# EAGLE schematic SpectrumPlusKeyboardRGB (EAGLE 7.6.0)
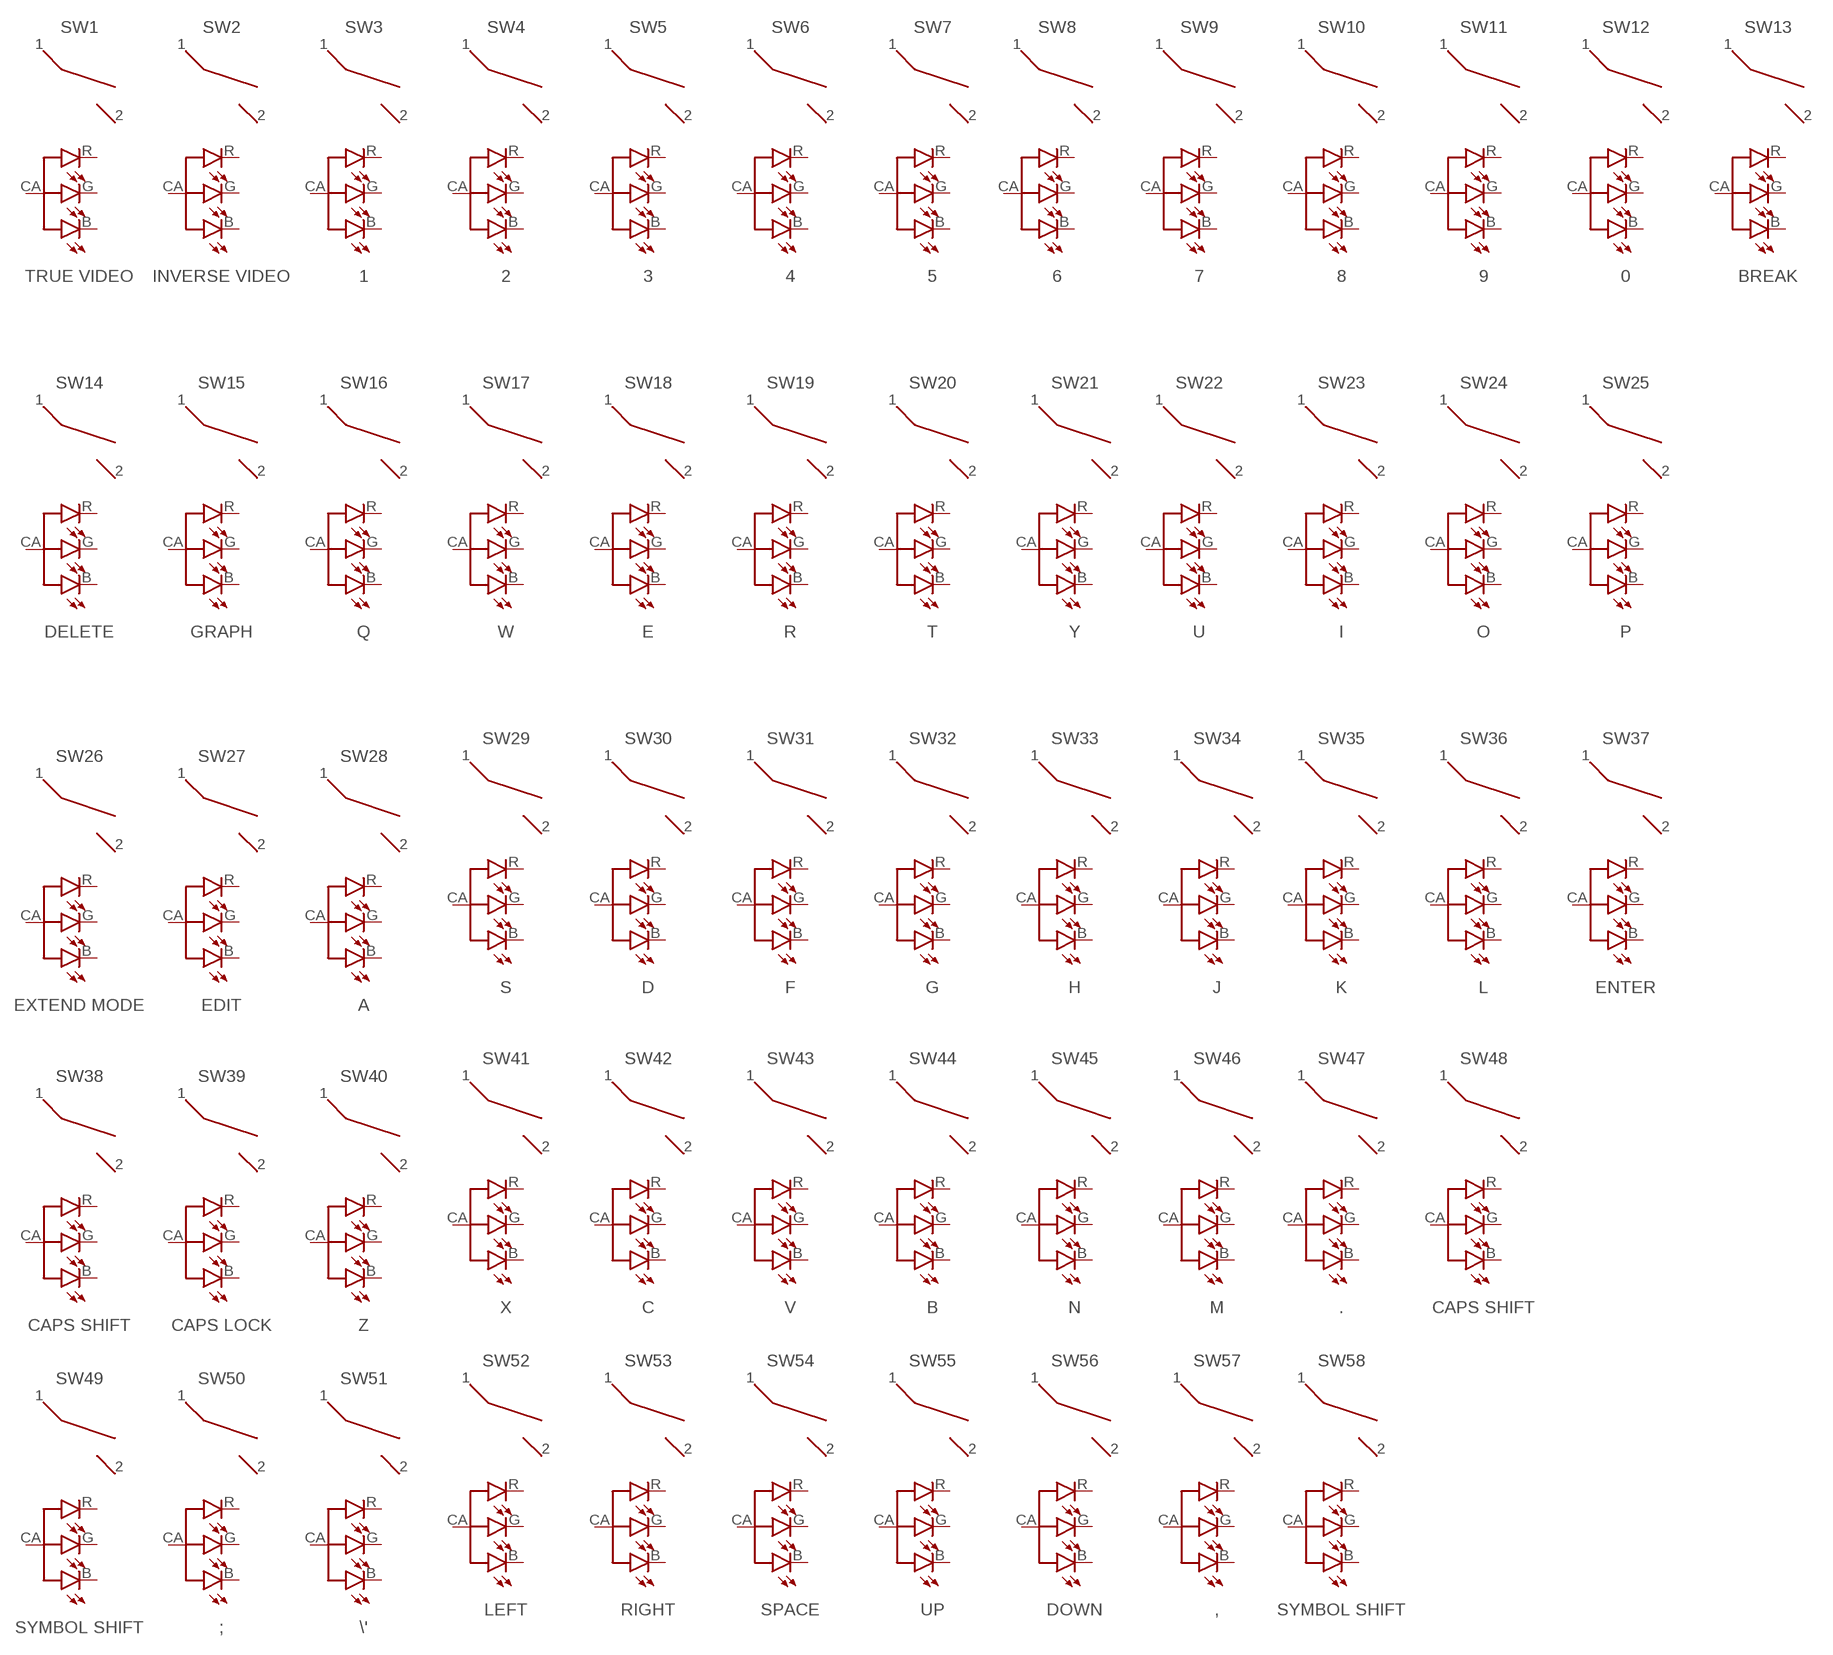
[diagram p0: schematic, sheet 1]

## Parts
SW1  TRUE VIDEO  ZEALIOSZX_1U  [ZX_1U]
SW2  INVERSE VIDEO  ZEALIOSZX_1U  [ZX_1U]
SW3  1  ZEALIOSZX_1U  [ZX_1U]
SW4  2  ZEALIOSZX_1U  [ZX_1U]
SW5  3  ZEALIOSZX_1U  [ZX_1U]
SW6  4  ZEALIOSZX_1U  [ZX_1U]
SW7  5  ZEALIOSZX_1U  [ZX_1U]
SW8  6  ZEALIOSZX_1U  [ZX_1U]
SW9  7  ZEALIOSZX_1U  [ZX_1U]
SW10  8  ZEALIOSZX_1U  [ZX_1U]
SW11  9  ZEALIOSZX_1U  [ZX_1U]
SW12  0  ZEALIOSZX_1U  [ZX_1U]
SW13  BREAK  ZEALIOSZX_1.5U  [ZX_1.5U]
SW14  DELETE  ZEALIOSZX_1.5U  [ZX_1.5U]
SW15  GRAPH  ZEALIOSZX_1U  [ZX_1U]
SW16  Q  ZEALIOSZX_1U  [ZX_1U]
SW17  W  ZEALIOSZX_1U  [ZX_1U]
SW18  E  ZEALIOSZX_1U  [ZX_1U]
SW19  R  ZEALIOSZX_1U  [ZX_1U]
SW20  T  ZEALIOSZX_1U  [ZX_1U]
SW21  Y  ZEALIOSZX_1U  [ZX_1U]
SW22  U  ZEALIOSZX_1U  [ZX_1U]
SW23  I  ZEALIOSZX_1U  [ZX_1U]
SW24  O  ZEALIOSZX_1U  [ZX_1U]
SW25  P  ZEALIOSZX_1U  [ZX_1U]
SW26  EXTEND MODE  ZEALIOSZX_1.5U  [ZX_1.5U]
SW27  EDIT  ZEALIOSZX_1.25U  [ZX_1.25U]
SW28  A  ZEALIOSZX_1U  [ZX_1U]
SW29  S  ZEALIOSZX_1U  [ZX_1U]
SW30  D  ZEALIOSZX_1U  [ZX_1U]
SW31  F  ZEALIOSZX_1U  [ZX_1U]
SW32  G  ZEALIOSZX_1U  [ZX_1U]
SW33  H  ZEALIOSZX_1U  [ZX_1U]
SW34  J  ZEALIOSZX_1U  [ZX_1U]
SW35  K  ZEALIOSZX_1U  [ZX_1U]
SW36  L  ZEALIOSZX_1U  [ZX_1U]
SW37  ENTER  ZEALIOSZX_ENTER  [ZX_ENTER]
SW38  CAPS SHIFT  ZEALIOSZX_2.3U  [ZX_2.3U]
SW39  CAPS LOCK  ZEALIOSZX_1U  [ZX_1U]
SW40  Z  ZEALIOSZX_1U  [ZX_1U]
SW41  X  ZEALIOSZX_1U  [ZX_1U]
SW42  C  ZEALIOSZX_1U  [ZX_1U]
SW43  V  ZEALIOSZX_1U  [ZX_1U]
SW44  B  ZEALIOSZX_1U  [ZX_1U]
SW45  N  ZEALIOSZX_1U  [ZX_1U]
SW46  M  ZEALIOSZX_1U  [ZX_1U]
SW47  .  ZEALIOSZX_1U  [ZX_1U]
SW48  CAPS SHIFT  ZEALIOSZX_2.3U  [ZX_2.3U]
SW49  SYMBOL SHIFT  ZEALIOSZX_1U  [ZX_1U]
SW50  ;  ZEALIOSZX_1U  [ZX_1U]
SW51  \'  ZEALIOSZX_1U  [ZX_1U]
SW52  LEFT  ZEALIOSZX_1U  [ZX_1U]
SW53  RIGHT  ZEALIOSZX_1U  [ZX_1U]
SW54  SPACE  ZEALIOSZX_SPACE  [ZX_SPACE]
SW55  UP  ZEALIOSZX_1U  [ZX_1U]
SW56  DOWN  ZEALIOSZX_1U  [ZX_1U]
SW57  ,  ZEALIOSZX_1U  [ZX_1U]
SW58  SYMBOL SHIFT  ZEALIOSZX_1U  [ZX_1U]
Unconnected: SW1.1 SW1.2 SW1.B(B-CAT) SW1.CA(COMMON-ANODE) SW1.G(G-CAT) SW1.R(R-CAT) SW2.1 SW2.2 SW2.B(B-CAT) SW2.CA(COMMON-ANODE) SW2.G(G-CAT) SW2.R(R-CAT) SW3.1 SW3.2 SW3.B(B-CAT) SW3.CA(COMMON-ANODE) SW3.G(G-CAT) SW3.R(R-CAT) SW4.1 SW4.2 SW4.B(B-CAT) SW4.CA(COMMON-ANODE) SW4.G(G-CAT) SW4.R(R-CAT) SW5.1 SW5.2 SW5.B(B-CAT) SW5.CA(COMMON-ANODE) SW5.G(G-CAT) SW5.R(R-CAT) SW6.1 SW6.2 SW6.B(B-CAT) SW6.CA(COMMON-ANODE) SW6.G(G-CAT) SW6.R(R-CAT) SW7.1 SW7.2 SW7.B(B-CAT) SW7.CA(COMMON-ANODE) SW7.G(G-CAT) SW7.R(R-CAT) SW8.1 SW8.2 SW8.B(B-CAT) SW8.CA(COMMON-ANODE) SW8.G(G-CAT) SW8.R(R-CAT) SW9.1 SW9.2 SW9.B(B-CAT) SW9.CA(COMMON-ANODE) SW9.G(G-CAT) SW9.R(R-CAT) SW10.1 SW10.2 SW10.B(B-CAT) SW10.CA(COMMON-ANODE) SW10.G(G-CAT) SW10.R(R-CAT) SW11.1 SW11.2 SW11.B(B-CAT) SW11.CA(COMMON-ANODE) SW11.G(G-CAT) SW11.R(R-CAT) SW12.1 SW12.2 SW12.B(B-CAT) SW12.CA(COMMON-ANODE) SW12.G(G-CAT) SW12.R(R-CAT) SW13.1 SW13.2 SW13.B(B-CAT) SW13.CA(COMMON-ANODE) SW13.G(G-CAT) SW13.R(R-CAT) SW14.1 SW14.2 SW14.B(B-CAT) SW14.CA(COMMON-ANODE) SW14.G(G-CAT) SW14.R(R-CAT) SW15.1 SW15.2 SW15.B(B-CAT) SW15.CA(COMMON-ANODE) SW15.G(G-CAT) SW15.R(R-CAT) SW16.1 SW16.2 SW16.B(B-CAT) SW16.CA(COMMON-ANODE) SW16.G(G-CAT) SW16.R(R-CAT) SW17.1 SW17.2 SW17.B(B-CAT) SW17.CA(COMMON-ANODE) SW17.G(G-CAT) SW17.R(R-CAT) SW18.1 SW18.2 SW18.B(B-CAT) SW18.CA(COMMON-ANODE) SW18.G(G-CAT) SW18.R(R-CAT) SW19.1 SW19.2 SW19.B(B-CAT) SW19.CA(COMMON-ANODE) SW19.G(G-CAT) SW19.R(R-CAT) SW20.1 SW20.2 SW20.B(B-CAT) SW20.CA(COMMON-ANODE) SW20.G(G-CAT) SW20.R(R-CAT) SW21.1 SW21.2 SW21.B(B-CAT) SW21.CA(COMMON-ANODE) SW21.G(G-CAT) SW21.R(R-CAT) SW22.1 SW22.2 SW22.B(B-CAT) SW22.CA(COMMON-ANODE) SW22.G(G-CAT) SW22.R(R-CAT) SW23.1 SW23.2 SW23.B(B-CAT) SW23.CA(COMMON-ANODE) SW23.G(G-CAT) SW23.R(R-CAT) SW24.1 SW24.2 SW24.B(B-CAT) SW24.CA(COMMON-ANODE) SW24.G(G-CAT) SW24.R(R-CAT) SW25.1 SW25.2 SW25.B(B-CAT) SW25.CA(COMMON-ANODE) SW25.G(G-CAT) SW25.R(R-CAT) SW26.1 SW26.2 SW26.B(B-CAT) SW26.CA(COMMON-ANODE) SW26.G(G-CAT) SW26.R(R-CAT) SW27.1 SW27.2 SW27.B(B-CAT) SW27.CA(COMMON-ANODE) SW27.G(G-CAT) SW27.R(R-CAT) SW28.1 SW28.2 SW28.B(B-CAT) SW28.CA(COMMON-ANODE) SW28.G(G-CAT) SW28.R(R-CAT) SW29.1 SW29.2 SW29.B(B-CAT) SW29.CA(COMMON-ANODE) SW29.G(G-CAT) SW29.R(R-CAT) SW30.1 SW30.2 SW30.B(B-CAT) SW30.CA(COMMON-ANODE) SW30.G(G-CAT) SW30.R(R-CAT) SW31.1 SW31.2 SW31.B(B-CAT) SW31.CA(COMMON-ANODE) SW31.G(G-CAT) SW31.R(R-CAT) SW32.1 SW32.2 SW32.B(B-CAT) SW32.CA(COMMON-ANODE) SW32.G(G-CAT) SW32.R(R-CAT) SW33.1 SW33.2 SW33.B(B-CAT) SW33.CA(COMMON-ANODE) SW33.G(G-CAT) SW33.R(R-CAT) SW34.1 SW34.2 SW34.B(B-CAT) SW34.CA(COMMON-ANODE) SW34.G(G-CAT) SW34.R(R-CAT) SW35.1 SW35.2 SW35.B(B-CAT) SW35.CA(COMMON-ANODE) SW35.G(G-CAT) SW35.R(R-CAT) SW36.1 SW36.2 SW36.B(B-CAT) SW36.CA(COMMON-ANODE) SW36.G(G-CAT) SW36.R(R-CAT) SW37.1 SW37.2 SW37.B(B-CAT) SW37.CA(COMMON-ANODE) SW37.G(G-CAT) SW37.R(R-CAT) SW38.1 SW38.2 SW38.B(B-CAT) SW38.CA(COMMON-ANODE) SW38.G(G-CAT) SW38.R(R-CAT) SW39.1 SW39.2 SW39.B(B-CAT) SW39.CA(COMMON-ANODE) SW39.G(G-CAT) SW39.R(R-CAT) SW40.1 SW40.2 SW40.B(B-CAT) SW40.CA(COMMON-ANODE) SW40.G(G-CAT) SW40.R(R-CAT) SW41.1 SW41.2 SW41.B(B-CAT) SW41.CA(COMMON-ANODE) SW41.G(G-CAT) SW41.R(R-CAT) SW42.1 SW42.2 SW42.B(B-CAT) SW42.CA(COMMON-ANODE) SW42.G(G-CAT) SW42.R(R-CAT) SW43.1 SW43.2 SW43.B(B-CAT) SW43.CA(COMMON-ANODE) SW43.G(G-CAT) SW43.R(R-CAT) SW44.1 SW44.2 SW44.B(B-CAT) SW44.CA(COMMON-ANODE) SW44.G(G-CAT) SW44.R(R-CAT) SW45.1 SW45.2 SW45.B(B-CAT) SW45.CA(COMMON-ANODE) SW45.G(G-CAT) SW45.R(R-CAT) SW46.1 SW46.2 SW46.B(B-CAT) SW46.CA(COMMON-ANODE) SW46.G(G-CAT) SW46.R(R-CAT) SW47.1 SW47.2 SW47.B(B-CAT) SW47.CA(COMMON-ANODE) SW47.G(G-CAT) SW47.R(R-CAT) SW48.1 SW48.2 SW48.B(B-CAT) SW48.CA(COMMON-ANODE) SW48.G(G-CAT) SW48.R(R-CAT) SW49.1 SW49.2 SW49.B(B-CAT) SW49.CA(COMMON-ANODE) SW49.G(G-CAT) SW49.R(R-CAT) SW50.1 SW50.2 SW50.B(B-CAT) SW50.CA(COMMON-ANODE) SW50.G(G-CAT) SW50.R(R-CAT) SW51.1 SW51.2 SW51.B(B-CAT) SW51.CA(COMMON-ANODE) SW51.G(G-CAT) SW51.R(R-CAT) SW52.1 SW52.2 SW52.B(B-CAT) SW52.CA(COMMON-ANODE) SW52.G(G-CAT) SW52.R(R-CAT) SW53.1 SW53.2 SW53.B(B-CAT) SW53.CA(COMMON-ANODE) SW53.G(G-CAT) SW53.R(R-CAT) SW54.1 SW54.2 SW54.B(B-CAT) SW54.CA(COMMON-ANODE) SW54.G(G-CAT) SW54.R(R-CAT) SW55.1 SW55.2 SW55.B(B-CAT) SW55.CA(COMMON-ANODE) SW55.G(G-CAT) SW55.R(R-CAT) SW56.1 SW56.2 SW56.B(B-CAT) SW56.CA(COMMON-ANODE) SW56.G(G-CAT) SW56.R(R-CAT) SW57.1 SW57.2 SW57.B(B-CAT) SW57.CA(COMMON-ANODE) SW57.G(G-CAT) SW57.R(R-CAT) SW58.1 SW58.2 SW58.B(B-CAT) SW58.CA(COMMON-ANODE) SW58.G(G-CAT) SW58.R(R-CAT)

## Library data of the parts
SW1-SW58 = Cherry_MX_v7.0:ZEALIOS